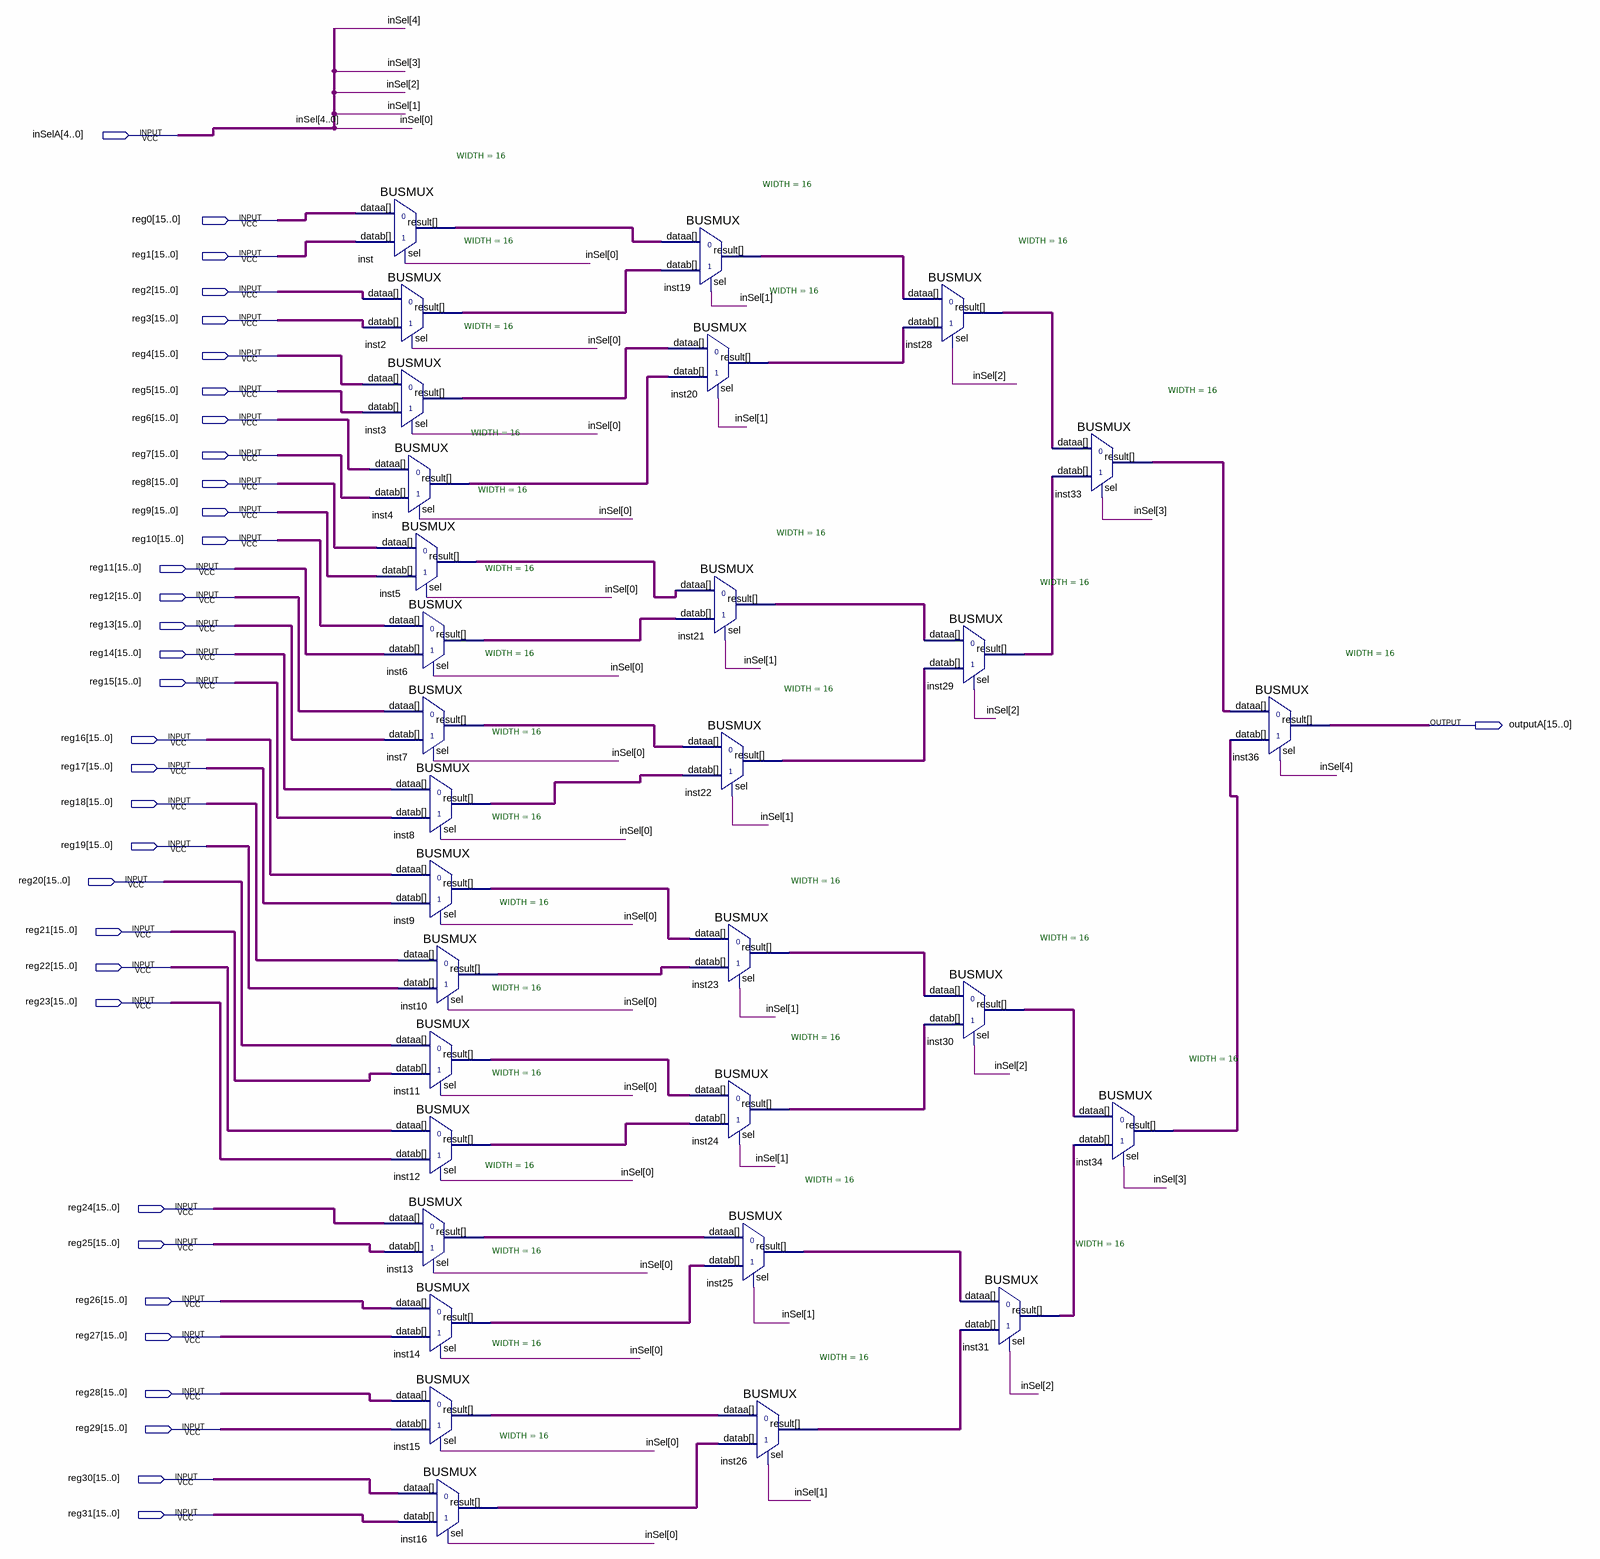
[diagram p0: schematic sheet]
// Quartus schematic ev20B3BUSA.bdf as structural Verilog: 31 symbols, 34 pins
module ev20B3BUSA (
  input  [4:0] inSelA,
  input  [15:0] reg0,
  input  [15:0] reg1,
  input  [15:0] reg2,
  input  [15:0] reg3,
  input  [15:0] reg4,
  input  [15:0] reg5,
  input  [15:0] reg6,
  input  [15:0] reg7,
  input  [15:0] reg8,
  input  [15:0] reg9,
  input  [15:0] reg10,
  input  [15:0] reg11,
  input  [15:0] reg12,
  input  [15:0] reg13,
  input  [15:0] reg14,
  input  [15:0] reg15,
  input  [15:0] reg16,
  input  [15:0] reg17,
  input  [15:0] reg18,
  input  [15:0] reg19,
  input  [15:0] reg20,
  input  [15:0] reg21,
  input  [15:0] reg22,
  input  [15:0] reg23,
  input  [15:0] reg24,
  input  [15:0] reg25,
  input  [15:0] reg26,
  input  [15:0] reg27,
  input  [15:0] reg28,
  input  [15:0] reg29,
  input  [15:0] reg30,
  input  [15:0] reg31,
  output [15:0] outputA
);

  wire [15:0] inst2_result, inst3_result, inst4_result, inst5_result, inst6_result, inst7_result,
       inst8_result, inst9_result, inst10_result, inst11_result, inst12_result, inst13_result, inst14_result,
       inst15_result, inst16_result, inst19_result, inst20_result, inst21_result, inst22_result,
       inst23_result, inst24_result, inst25_result, inst26_result, inst28_result, inst29_result,
       inst30_result, inst31_result, inst33_result, inst34_result, inst_result;

  BUSMUX #(.WIDTH(16)) inst (.datab(reg1), .sel(inSelA[0]), .dataa(reg0), .result(inst_result));
  BUSMUX #(.WIDTH(16)) inst2 (.datab(reg3), .sel(inSelA[0]), .dataa(reg2), .result(inst2_result));
  BUSMUX #(.WIDTH(16)) inst3 (.datab(reg5), .sel(inSelA[0]), .dataa(reg4), .result(inst3_result));
  BUSMUX #(.WIDTH(16)) inst4 (.datab(reg7), .sel(inSelA[0]), .dataa(reg6), .result(inst4_result));
  BUSMUX #(.WIDTH(16)) inst5 (.datab(reg9), .sel(inSelA[0]), .dataa(reg8), .result(inst5_result));
  BUSMUX #(.WIDTH(16)) inst6 (.datab(reg11), .sel(inSelA[0]), .dataa(reg10), .result(inst6_result));
  BUSMUX #(.WIDTH(16)) inst7 (.datab(reg13), .sel(inSelA[0]), .dataa(reg12), .result(inst7_result));
  BUSMUX #(.WIDTH(16)) inst8 (.datab(reg15), .sel(inSelA[0]), .dataa(reg14), .result(inst8_result));
  BUSMUX #(.WIDTH(16)) inst9 (.datab(reg17), .sel(inSelA[0]), .dataa(reg16), .result(inst9_result));
  BUSMUX #(.WIDTH(16)) inst10 (.datab(reg19), .sel(inSelA[0]), .dataa(reg18), .result(inst10_result));
  BUSMUX #(.WIDTH(16)) inst11 (.datab(reg21), .sel(inSelA[0]), .dataa(reg20), .result(inst11_result));
  BUSMUX #(.WIDTH(16)) inst12 (.datab(reg23), .sel(inSelA[0]), .dataa(reg22), .result(inst12_result));
  BUSMUX #(.WIDTH(16)) inst13 (.datab(reg25), .sel(inSelA[0]), .dataa(reg24), .result(inst13_result));
  BUSMUX #(.WIDTH(16)) inst14 (.datab(reg27), .sel(inSelA[0]), .dataa(reg26), .result(inst14_result));
  BUSMUX #(.WIDTH(16)) inst15 (.datab(reg29), .sel(inSelA[0]), .dataa(reg28), .result(inst15_result));
  BUSMUX #(.WIDTH(16)) inst16 (.datab(reg31), .sel(inSelA[0]), .dataa(reg30), .result(inst16_result));
  BUSMUX #(.WIDTH(16)) inst19 (.datab(inst2_result), .sel(inSelA[1]), .dataa(inst_result), .result(inst19_result));
  BUSMUX #(.WIDTH(16)) inst20 (.datab(inst4_result), .sel(inSelA[1]), .dataa(inst3_result), .result(inst20_result));
  BUSMUX #(.WIDTH(16)) inst21 (.datab(inst6_result), .sel(inSelA[1]), .dataa(inst5_result), .result(inst21_result));
  BUSMUX #(.WIDTH(16)) inst22 (.datab(inst8_result), .sel(inSelA[1]), .dataa(inst7_result), .result(inst22_result));
  BUSMUX #(.WIDTH(16)) inst23 (.datab(inst10_result), .sel(inSelA[1]), .dataa(inst9_result), .result(inst23_result));
  BUSMUX #(.WIDTH(16)) inst24 (.datab(inst12_result), .sel(inSelA[1]), .dataa(inst11_result), .result(inst24_result));
  BUSMUX #(.WIDTH(16)) inst25 (.datab(inst14_result), .sel(inSelA[1]), .dataa(inst13_result), .result(inst25_result));
  BUSMUX #(.WIDTH(16)) inst26 (.datab(inst16_result), .sel(inSelA[1]), .dataa(inst15_result), .result(inst26_result));
  BUSMUX #(.WIDTH(16)) inst28 (.datab(inst20_result), .sel(inSelA[2]), .dataa(inst19_result), .result(inst28_result));
  BUSMUX #(.WIDTH(16)) inst29 (.datab(inst22_result), .sel(inSelA[2]), .dataa(inst21_result), .result(inst29_result));
  BUSMUX #(.WIDTH(16)) inst30 (.datab(inst24_result), .sel(inSelA[2]), .dataa(inst23_result), .result(inst30_result));
  BUSMUX #(.WIDTH(16)) inst31 (.datab(inst26_result), .sel(inSelA[2]), .dataa(inst25_result), .result(inst31_result));
  BUSMUX #(.WIDTH(16)) inst33 (.datab(inst29_result), .sel(inSelA[3]), .dataa(inst28_result), .result(inst33_result));
  BUSMUX #(.WIDTH(16)) inst34 (.datab(inst31_result), .sel(inSelA[3]), .dataa(inst30_result), .result(inst34_result));
  BUSMUX #(.WIDTH(16)) inst36 (.datab(inst34_result), .sel(inSelA[4]), .dataa(inst33_result), .result(outputA));

  // Other names for the same wires on the sheet: inSel[4:0] = inSelA
endmodule
